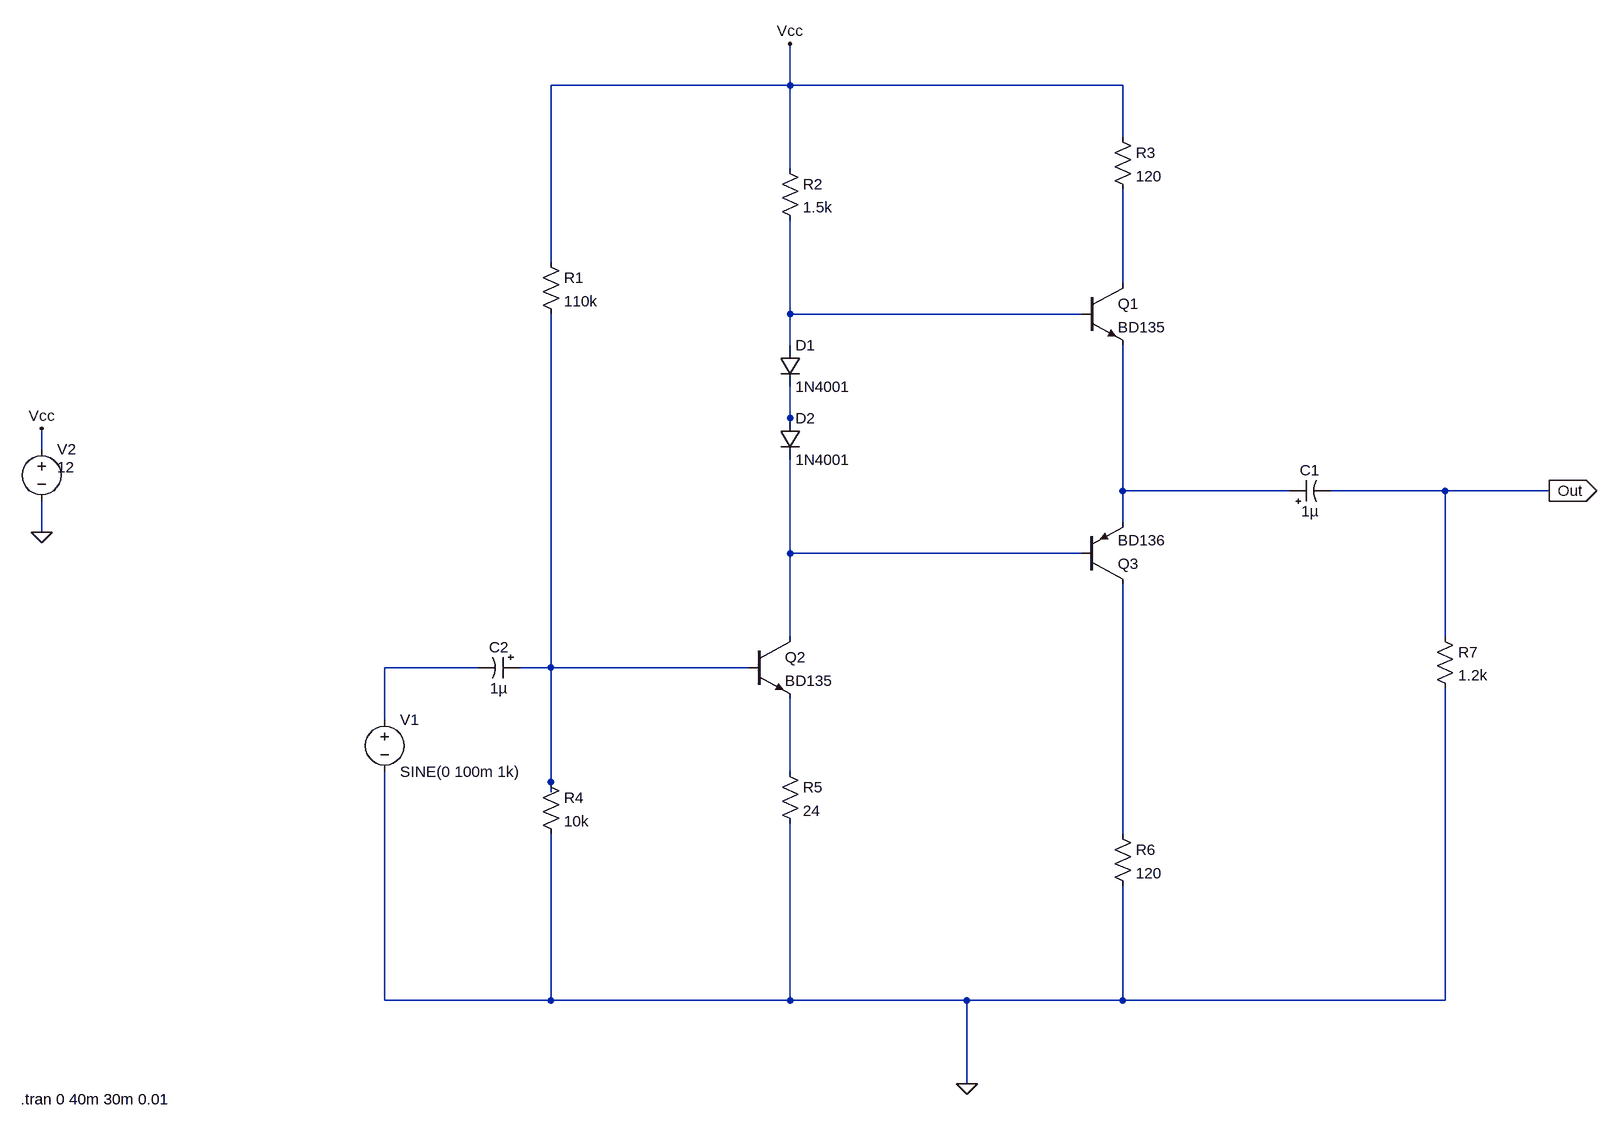
[diagram p0: schematic PowAmp_05_02_03_class_AB.asc]
PowAmp_05_02_03_class_AB.asc, the LTspice schematic file:
Version 4
SHEET 1 1580 1208
WIRE 288 -368 288 -432
WIRE 288 -368 -80 -368
WIRE 800 -368 288 -368
WIRE 800 -288 800 -368
WIRE 288 -240 288 -368
WIRE -80 -96 -80 -368
WIRE 800 -64 800 -208
WIRE 288 -16 288 -160
WIRE 736 -16 288 -16
WIRE 288 32 288 -16
WIRE 288 144 288 96
WIRE 288 160 288 144
WIRE -864 192 -864 160
WIRE 800 256 800 32
WIRE 1056 256 800 256
WIRE 1296 256 1120 256
WIRE 1456 256 1296 256
WIRE 800 304 800 256
WIRE -864 320 -864 272
WIRE 288 352 288 208
WIRE 736 352 288 352
WIRE 288 480 288 352
WIRE 1296 480 1296 256
WIRE -192 528 -336 528
WIRE -80 528 -80 -16
WIRE -80 528 -128 528
WIRE 224 528 -80 528
WIRE -336 608 -336 528
WIRE 288 688 288 576
WIRE -80 704 -80 528
WIRE -80 720 -80 704
WIRE 800 784 800 400
WIRE -336 1040 -336 688
WIRE -80 1040 -80 784
WIRE -80 1040 -336 1040
WIRE 288 1040 288 768
WIRE 288 1040 -80 1040
WIRE 560 1040 288 1040
WIRE 800 1040 800 864
WIRE 800 1040 560 1040
WIRE 1296 1040 1296 560
WIRE 1296 1040 800 1040
WIRE 560 1168 560 1040
FLAG 560 1168 0
FLAG 1456 256 Out
IOPIN 1456 256 Out
FLAG -864 320 0
FLAG -864 160 Vcc
FLAG 288 -432 Vcc
SYMBOL res -96 -112 R0
SYMATTR InstName R1
SYMATTR Value 110k
SYMBOL res 272 -256 R0
SYMATTR InstName R2
SYMATTR Value 1.5k
SYMBOL res 784 -304 R0
SYMATTR InstName R3
SYMATTR Value 120
SYMBOL res -96 688 R0
SYMATTR InstName R4
SYMATTR Value 10k
SYMBOL res 272 672 R0
SYMATTR InstName R5
SYMATTR Value 24
SYMBOL res 784 768 R0
SYMATTR InstName R6
SYMATTR Value 120
SYMBOL res 1280 464 R0
SYMATTR InstName R7
SYMATTR Value 1.2k
SYMBOL polcap 1056 272 R270
WINDOW 0 32 32 VTop 2
WINDOW 3 0 32 VBottom 2
SYMATTR InstName C1
SYMATTR Value 1µ
SYMBOL polcap -128 512 R90
WINDOW 0 0 32 VBottom 2
WINDOW 3 32 32 VTop 2
SYMATTR InstName C2
SYMATTR Value 1µ
SYMBOL voltage -336 592 R0
WINDOW 123 0 0 Left 2
WINDOW 39 0 0 Left 2
SYMATTR InstName V1
SYMATTR Value SINE(0 100m 1k)
SYMBOL voltage -864 176 R0
WINDOW 3 24 44 Left 2
WINDOW 123 0 0 Left 2
WINDOW 39 0 0 Left 2
SYMATTR Value 12
SYMATTR InstName V2
SYMBOL npn2 736 -64 R0
SYMATTR InstName Q1
SYMATTR Value BD135
SYMBOL npn2 224 480 R0
SYMATTR InstName Q2
SYMATTR Value BD135
SYMBOL pnp2 736 400 M180
SYMATTR InstName Q3
SYMATTR Value BD136
SYMBOL diode 272 32 R0
SYMATTR InstName D1
SYMATTR Value 1N4001
SYMBOL diode 272 144 R0
SYMATTR InstName D2
SYMATTR Value 1N4001
TEXT -896 1192 Left 2 !.tran 0 40m 30m 0.01

The netlist it stands for:
* PowAmp_05_02_03_class_AB.asc
R1 Vcc N007 110k
R2 Vcc N002 1.5k
R3 Vcc N001 120
R4 N007 0 10k
R5 N008 0 24
R6 N009 0 120
R7 Out 0 1.2k
C1 N004 Out 1µ
C2 N007 N006 1µ
V1 N006 0 SINE(0 100m 1k)
V2 Vcc 0 12
Q1 N001 N002 N004 0 BD135
Q2 N005 N007 N008 0 BD135
Q3 N009 N005 N004 0 BD136
D1 N002 N003 1N4001
D2 N003 N005 1N4001
.model D D
.lib standard.dio
.model NPN NPN
.model PNP PNP
.lib standard.bjt
.tran 0 40m 30m 0.01
.backanno
.end